# Altium project EL.PLAM.T01.PrjPcb
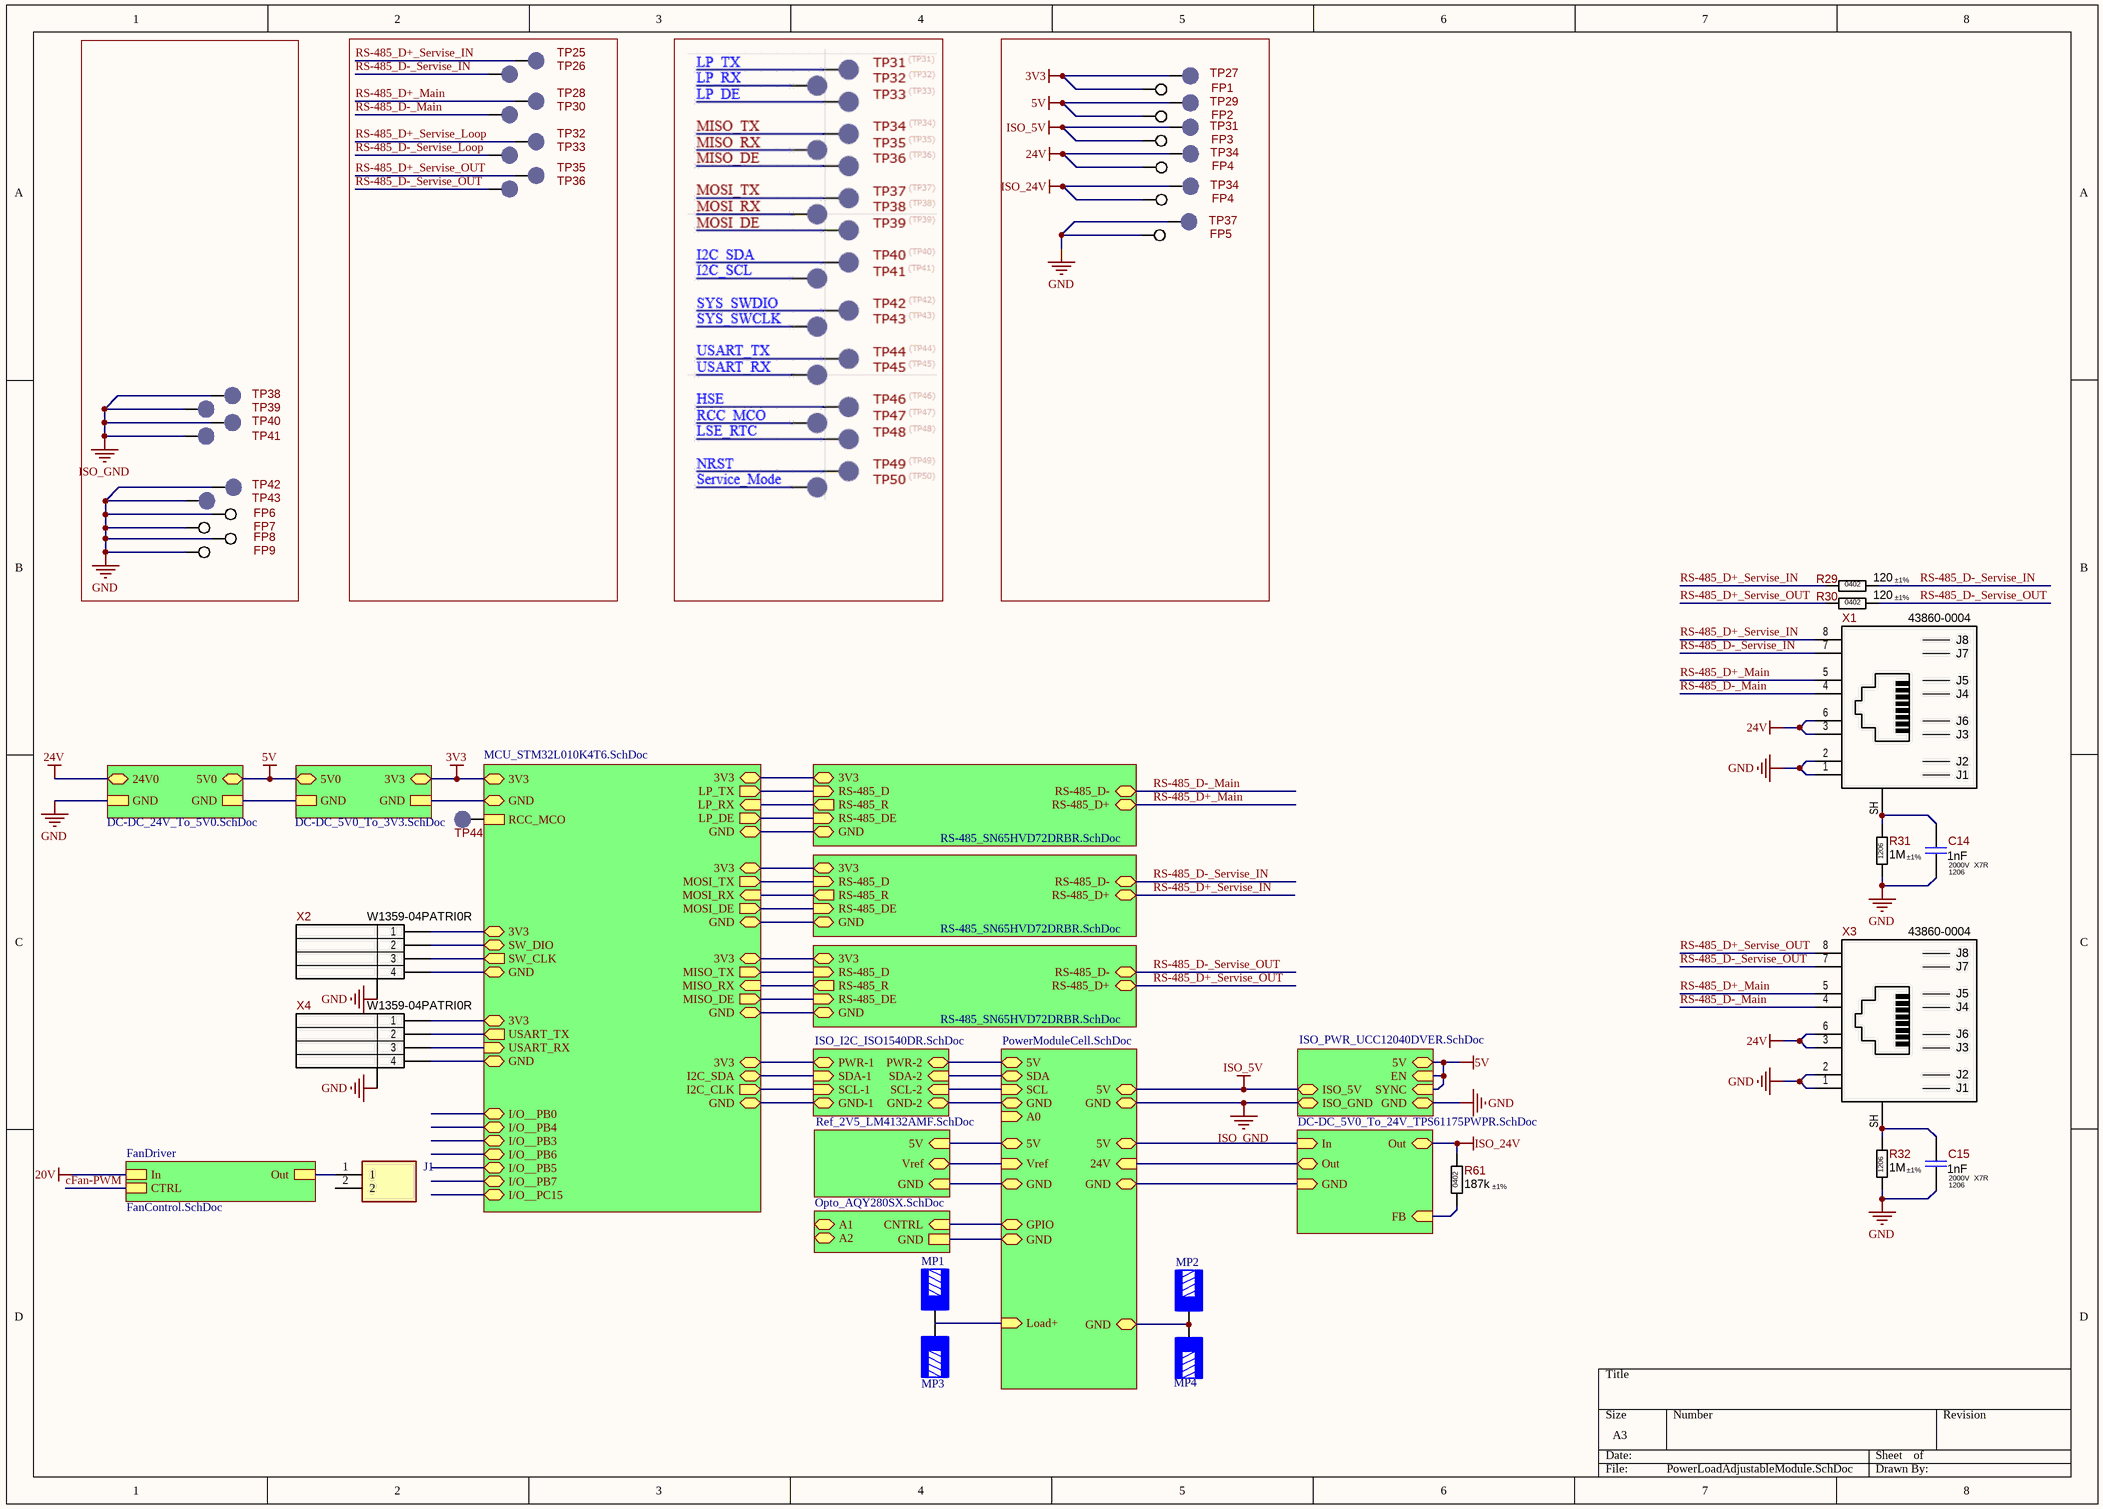
[diagram p0: PowerLoadAdjustableModule.SchDoc]
3 sheets, 121 parts. Net scope: hierarchical (ports join the sheet entries above them; power ports are global).
Board file: PowerLoadAdjustableModule.PcbDoc
Sheets:
  PowerLoadAdjustableModule.SchDoc
    PowerModuleCell = PowerModuleCell.SchDoc
    FanDriver = FanControl.SchDoc

## Sheet PowerLoadAdjustableModule.SchDoc
size A3; SheetNumber: 1; SheetTotal: 8

### Parts
(Parts that share a designator on the sheet are numbered #1, #2 ... from top to bottom, then left to right.)
C14  Package: 1206  Voltage: 2000V  Dielectric Type: X7R  [CAP-1206(3216)X125T20]  (hidden comment: 1nF)
C15  Package: 1206  Voltage: 2000V  Dielectric Type: X7R  [CAP-1206(3216)X125T20]  (hidden comment: 1nF)
FP1  PAD-1.1mm  [PAD-1.1mm]  (value not drawn)  (no BOM)
FP2  PAD-1.1mm  [PAD-1.1mm]  (value not drawn)  (no BOM)
FP3  PAD-1.1mm  [PAD-1.1mm]  (value not drawn)  (no BOM)
FP4#1  PAD-1.1mm  [PAD-1.1mm]  (value not drawn)  (no BOM)
FP4#2  PAD-1.1mm  [PAD-1.1mm]  (value not drawn)  (no BOM)
FP5  PAD-1.1mm  [PAD-1.1mm]  (value not drawn)  (no BOM)
FP6  PAD-1.1mm  [PAD-1.1mm]  (value not drawn)  (no BOM)
FP7  PAD-1.1mm  [PAD-1.1mm]  (value not drawn)  (no BOM)
FP8  PAD-1.1mm  [PAD-1.1mm]  (value not drawn)  (no BOM)
FP9  PAD-1.1mm  [PAD-1.1mm]  (value not drawn)  (no BOM)
J1  1725656  [1725656]  (value not drawn)
MP1  M6 x 9mm  [7461084_HAL]  (value not drawn)
MP2  M6 x 9mm  [7461084_HAL]  (value not drawn)
MP3  M6 x 9mm  [7461084_HAL]  (value not drawn)
MP4  M6 x 9mm  [7461084_HAL]  (value not drawn)
R29  Tolerance: ±1%  Package: 0402  [R_ANY_CHIP_0402_HI]  (hidden comment: 120)
R30  Tolerance: ±1%  Package: 0402  [R_ANY_CHIP_0402_HI]  (hidden comment: 120)
R31  Tolerance: ±1%  Package: 1206  [CHV1206-Series]  (hidden comment: 1M)
R32  Tolerance: ±1%  Package: 1206  [CHV1206-Series]  (hidden comment: 1M)
R61  Tolerance: ±1%  Package: 0402  [R_ANY_CHIP_0402_MED]  (hidden comment: 187k)
TP25  LED_LINK  [TP_SMD_2mm]  (value not drawn)  (no BOM)
TP26  LED_LINK  [TP_SMD_2mm]  (value not drawn)  (no BOM)
TP27  LED_LINK  [TP_SMD_2mm]  (value not drawn)  (no BOM)
TP28  LED_LINK  [TP_SMD_2mm]  (value not drawn)  (no BOM)
TP29  LED_LINK  [TP_SMD_2mm]  (value not drawn)  (no BOM)
TP30  LED_LINK  [TP_SMD_2mm]  (value not drawn)  (no BOM)
TP31  LED_LINK  [TP_SMD_2mm]  (value not drawn)  (no BOM)
TP32  LED_LINK  [TP_SMD_2mm]  (value not drawn)  (no BOM)
TP33  LED_LINK  [TP_SMD_2mm]  (value not drawn)  (no BOM)
TP34#1  LED_LINK  [TP_SMD_2mm]  (value not drawn)  (no BOM)
TP34#2  LED_LINK  [TP_SMD_2mm]  (value not drawn)  (no BOM)
TP35  LED_LINK  [TP_SMD_2mm]  (value not drawn)  (no BOM)
TP36  LED_LINK  [TP_SMD_2mm]  (value not drawn)  (no BOM)
TP37  LED_LINK  [TP_SMD_2mm]  (value not drawn)  (no BOM)
TP38  LED_LINK  [TP_SMD_2mm]  (value not drawn)  (no BOM)
TP39  LED_LINK  [TP_SMD_2mm]  (value not drawn)  (no BOM)
TP40  LED_LINK  [TP_SMD_2mm]  (value not drawn)  (no BOM)
TP41  LED_LINK  [TP_SMD_2mm]  (value not drawn)  (no BOM)
TP42  LED_LINK  [TP_SMD_2mm]  (value not drawn)  (no BOM)
TP43  LED_LINK  [TP_SMD_2mm]  (value not drawn)  (no BOM)
TP44  LED_LINK  [TP_SMD_2mm]  (value not drawn)  (no BOM)
X1  43860-0004  [43860-0004]
X2  W1359-04PATRI0R  [W1359-04PATXI0R_DBG]
X3  43860-0004  [43860-0004]
X4  W1359-04PATRI0R  [W1359-04PATXI0R_DBG]

### Sub-sheets
CellSelectModule = Opto_AQY280SX.SchDoc (file not in this document): CNTRL (in), A1 (bidir), A2 (bidir), GND
FanDriver = FanControl.SchDoc: In, Out, CTRL
ISO_5V = ISO_PWR_UCC12040DVER.SchDoc (file not in this document): ISO_5V (bidir), 5V (bidir), GND (bidir), ISO_GND (bidir), EN (in), SYNC (in)
ISO_I2C = ISO_I2C_ISO1540DR.SchDoc (file not in this document): PWR-2 (bidir), PWR-1 (bidir), GND-1 (bidir), GND-2 (bidir), SDA-1 (in), SCL-1 (in), SDA-2 (in), SCL-2 (in)
ISO_I2C = Ref_2V5_LM4132AMF.SchDoc (file not in this document): Vref (bidir), 5V (in), GND (in)
ISO_I2C = DC-DC_5V0_To_24V_TPS61175PWPR.SchDoc (file not in this document): Out (bidir), In (in), GND (in), Out (bidir), FB (in)
LDO_3V3 = DC-DC_5V0_To_3V3.SchDoc (file not in this document): 3V3 (bidir), 5V0 (bidir), GND, GND
LDO_3V3 = DC-DC_24V_To_5V0.SchDoc (file not in this document): 5V0 (bidir), 24V0 (bidir), GND, GND
MCU = MCU_STM32L010K4T6.SchDoc (file not in this document): LP_TX (out), LP_RX (in), LP_DE (out), MISO_TX (out), MISO_RX (in), MISO_DE (out), MOSI_RX (in), MOSI_TX (out), MOSI_DE (out), I2C_SDA (bidir), I2C_CLK (out), SW_DIO (bidir), SW_CLK (out), USART_TX (out), USART_RX (in), RCC_MCO, I/O__PB0 (bidir), I/O__PB3 (bidir), I/O__PB4 (bidir), I/O__PB5 (bidir), I/O__PB6 (bidir), I/O__PB7 (bidir), I/O__PC15 (bidir), 3V3 (bidir), 3V3 (bidir), 3V3 (bidir), 3V3 (bidir), 3V3 (bidir), GND (bidir), GND (bidir), GND (bidir), GND (bidir), GND (bidir), GND (bidir), GND (bidir), 3V3 (bidir), 3V3 (bidir)
PowerModuleCell = PowerModuleCell.SchDoc: 5V (bidir), GND (bidir), SDA (bidir), SCL (in), Load+ (in), 24V (in), A0 (in), GPIO (bidir), GND (bidir), 5V (bidir), Vref (in), 5V (bidir), GND (bidir), GND (bidir), GND (bidir), GND (bidir), 5V (bidir)
RS-485 = RS-485_SN65HVD72DRBR.SchDoc (file not in this document): 3V3 (bidir), RS-485_D+ (bidir), RS-485_D- (bidir), RS-485_R (out), RS-485_D (in), RS-485_DE (in), GND (bidir)
RS-485 = RS-485_SN65HVD72DRBR.SchDoc (file not in this document): 3V3 (bidir), RS-485_D+ (bidir), RS-485_D- (bidir), RS-485_R (out), RS-485_D (in), RS-485_DE (in), GND (bidir)
RS-485 = RS-485_SN65HVD72DRBR.SchDoc (file not in this document): 3V3 (bidir), RS-485_D+ (bidir), RS-485_D- (bidir), RS-485_R (out), RS-485_D (in), RS-485_DE (in), GND (bidir)

### Nets
3V3: FP1.1 TP27.1 ; sheet LDO_3V3/3V3, sheet MCU/3V3
5V: FP2.1 TP29.1 ; sheet LDO_3V3/5V0, sheet ISO_5V/5V, sheet ISO_5V/EN, sheet ISO_5V/SYNC, sheet LDO_3V3/5V0
24V: FP4#1.1 TP34#1.1 X1.3(TD3-) X1.6(CT) X3.3(TD3-) X3.6(CT) ; sheet LDO_3V3/24V0
GND: C14.2 C15.2 FP5.1 FP6.1 FP7.1 FP8.1 FP9.1 R31.2 R32.2 TP37.1 TP42.1 TP43.1 X1.1(TD4-) X1.2(TD4+) X2.MP(MountPad) X3.1(TD4-) X3.2(TD4+) X4.MP(MountPad) ; sheet ISO_5V/GND, sheet LDO_3V3/GND
ISO_5V: FP3.1 TP31.1 ; sheet ISO_5V/ISO_5V, sheet ISO_I2C/PWR-2, sheet PowerModuleCell/5V, sheet PowerModuleCell/5V, sheet PowerModuleCell/5V, sheet PowerModuleCell/5V, sheet ISO_I2C/5V, sheet ISO_I2C/In
ISO_24V: FP4#2.1 R61.1 TP34#2.1 ; sheet ISO_I2C/Out
ISO_GND: MP2.1 MP4.1 TP38.1 TP39.1 TP40.1 TP41.1 ; sheet ISO_5V/ISO_GND, sheet ISO_I2C/GND-2, sheet PowerModuleCell/GND, sheet PowerModuleCell/GND, sheet PowerModuleCell/GND, sheet PowerModuleCell/GND, sheet PowerModuleCell/GND, sheet PowerModuleCell/GND, sheet ISO_I2C/GND, sheet CellSelectModule/GND, sheet ISO_I2C/GND
RS-485_D+_Main: TP28.1 X1.5(CT) X3.5(CT) ; sheet RS-485/RS-485_D+
RS-485_D+_Servise_IN: R29.1 TP25.1 X1.8(TD2+) ; sheet RS-485/RS-485_D+
RS-485_D+_Servise_Loop: TP32.1
RS-485_D+_Servise_OUT: R30.1 TP35.1 X3.8(TD2+) ; sheet RS-485/RS-485_D+
RS-485_D-_Main: TP30.1 X1.4(TD3+) X3.4(TD3+) ; sheet RS-485/RS-485_D-
RS-485_D-_Servise_IN: R29.2 TP26.1 X1.7(TD2-) ; sheet RS-485/RS-485_D-
RS-485_D-_Servise_Loop: TP33.1
RS-485_D-_Servise_OUT: R30.2 TP36.1 X3.7(TD2-) ; sheet RS-485/RS-485_D-
Vout: J1.1 ; sheet FanDriver/Out
NetC1_2: sheet PowerModuleCell/24V, sheet ISO_I2C/Out
NetC14_1: C14.1 R31.1 X1.SH(Shield)
NetC15_1: C15.1 R32.1 X3.SH(Shield)
NetMP1_1: MP1.1 MP3.1
NetR61_2: R61.2 ; sheet ISO_I2C/FB
NetTP44_1: TP44.1 ; sheet MCU/RCC_MCO
NetU2_A1: sheet PowerModuleCell/Vref, sheet ISO_I2C/Vref
NetU2_A4: sheet PowerModuleCell/GPIO, sheet CellSelectModule/CNTRL
NetU2_B4: sheet ISO_I2C/SCL-2, sheet PowerModuleCell/SCL
NetU2_D4: sheet ISO_I2C/SDA-2, sheet PowerModuleCell/SDA
NetX2_1: X2.1 ; sheet MCU/3V3
NetX2_2: X2.2 ; sheet MCU/SW_DIO
NetX2_3: X2.3 ; sheet MCU/SW_CLK
NetX2_4: X2.4 ; sheet MCU/GND
NetX4_1: X4.1 ; sheet MCU/3V3
NetX4_2: X4.2 ; sheet MCU/USART_TX
NetX4_3: X4.3 ; sheet MCU/USART_RX
NetX4_4: X4.4 ; sheet MCU/GND
(unnamed): sheet LDO_3V3/GND, sheet MCU/GND
(unnamed): sheet LDO_3V3/GND, sheet LDO_3V3/GND
(unnamed): sheet ISO_I2C/PWR-1, sheet MCU/3V3
(unnamed): sheet ISO_I2C/GND-1, sheet MCU/GND
(unnamed): sheet ISO_I2C/SDA-1, sheet MCU/I2C_SDA
(unnamed): sheet ISO_I2C/SCL-1, sheet MCU/I2C_CLK
(unnamed): sheet MCU/LP_TX, sheet RS-485/RS-485_D
(unnamed): sheet MCU/LP_RX, sheet RS-485/RS-485_R
(unnamed): sheet MCU/LP_DE, sheet RS-485/RS-485_DE
(unnamed): sheet MCU/MISO_TX, sheet RS-485/RS-485_D
(unnamed): sheet MCU/MISO_RX, sheet RS-485/RS-485_R
(unnamed): sheet MCU/MISO_DE, sheet RS-485/RS-485_DE
(unnamed): sheet MCU/MOSI_RX, sheet RS-485/RS-485_R
(unnamed): sheet MCU/MOSI_TX, sheet RS-485/RS-485_D
(unnamed): sheet MCU/MOSI_DE, sheet RS-485/RS-485_DE
(unnamed): sheet MCU/3V3, sheet RS-485/3V3
(unnamed): sheet MCU/3V3, sheet RS-485/3V3
(unnamed): sheet MCU/GND, sheet RS-485/GND
(unnamed): sheet MCU/GND, sheet RS-485/GND
(unnamed): sheet MCU/GND, sheet RS-485/GND
(unnamed): sheet MCU/3V3, sheet RS-485/3V3

Not connected (* = marked no-connect by the designer): J1 2

### Notes on the sheet
- (in symbol 43860-0004) J8; J7; J5; J4; J6; J3; J2; J1

### Library data of the parts
C14 C15 = Capacitor-NonPolar: 1nF 2000V X7R ±10% 1206 Ceramic Capacitor RoHS; Part Number: CC1206KKX7RDBB102; Manufacturer: Yageo; Replacement: NONE; Value: 1nF; Part Type: Ceramic / X7R / 1206; Component Type: SMD; Temperature Range: -55°C ~ 125°C; Tolerance: ±10%; ComponentLink1URL: https://www.yageo.com/upload/media/product/products/datasheet/mlcc/UPY-NP0X7R_HV_1KV-to-3KV_11.pdf; Supplier 1: Digi-Key; Supplier Part Number 1: 311-1487-2-ND; ComponentLink1Description: Datasheet
FP1-FP3 FP4#1 FP4#2 FP5-FP9 = Pad: 1.1mm Pad for Plug-In or Receptacle; Manufacturer: NONE; Component Status: Released; Part Number: PAD-1.1mm; Component Type: PTH; Part Type: Pad; Temperature Range: NONE; ComponentLink1URL: NONE; Replacement: NONE; ComponentLink1Description: Datasheet; Price: NONE
J1 = 1725656: Connector; Manufacturer_Name: Phoenix Contact; Datasheet Link: https://www.phoenixcontact.com/online/portal/us/?uri=pxc-oc-itemdetail:pid=1725656&library=usen&pcck=P-11-01-05&tab=1&selectedCategory=ALL; Height: 8.65mm; Manufacturer_Part_Number: 1725656; Mouser Part Number: 651-1725656; Mouser Price/Stock: https://www.mouser.co.uk/ProductDetail/Phoenix-Contact/1725656?qs=Ul7CXFMnlWWQeccayYbRmw%3D%3D; Arrow Part Number: 1725656; Arrow Price/Stock: https://www.arrow.com/en/products/1725656/phoenix-contact?utm_currency=USD&region=nac
MP1-MP4 = 7461084: WP-BUTR REDCUBE PRESS-FIT with internal thread, two-rows, L10W10H13.5mm, M6 x 9mm, 160A; Manufacturer: Wurth Elektronik; Surface: Tin; ComponentLink1Description: Website Link; ComponentLink1URL: https://www.we-online.com/redexpert/article/7461084?ad; ComponentLink2Description: Datasheet Link; ComponentLink2URL: https://www.we-online.com/redexpert/spec/7461084?ad; Manufacturer Part Number: 7461084; Category: REDCUBE PRESS-FIT; Match Code: WP-BUTR; Mount: Press Fit; Operating Temperature Max: 150°C; Operating Temperature Min: -55°C; Packaging: Bulk; Length: 10mm; Width: 10mm; Height: 13.5mm; Material: Brass; Number of Pins: 8; Rated Current: 160A; Thread Length: 9mm; Thread Size: M6; Supplier 1: Mouser; Supplier Part Number 1: 710-7461084
R29 R30 = Resistor: 120 Ohms ±1% 1/16W 0402 Thick Film Resistor; Part Number: RC0402FR-07120RL; Manufacturer: Yageo; Power Rating: 0.062W; Voltage: 50V; Component Status: Released; Temperature Stability: ±100ppm/°C; Replacement: NONE; Value: 120; Component Type: SMD; Part Type: Thick Film; Temperature Range: -55°C ~ 155°C; ComponentLink1URL: https://eu.mouser.com/datasheet/2/447/PYu_RC_Group_51_RoHS_L_10-1664068.pdf; Price: 0.00065; ComponentLink1Description: Datasheet
R31 R32 = Resistor: 1 MOhms ±1%, 1/4W 1206 Thick Film Resistor; Part Number: CHV1206-FX-1004ELF; Manufacturer: Bourns; Power Rating: 0.25W; Voltage: 800V; Component Status: Released; Temperature Stability: ±100ppm/°C; Replacement: NONE; Value: 1M; Component Type: SMD; Part Type: Thick Film; Temperature Range: -55°C ~ 155°C; ComponentLink1URL: https://eu.mouser.com/datasheet/2/54/CHV-777595.pdf; Supplier 1: Mouser; Supplier Part Number 1: 652-CHV1206FX1004ELF; Price: 0.0173216; ComponentLink1Description: Datasheet
R61 = Resistor: 187 kOhms ±1% 1/16W 0402 Thick Film Resistor; Part Number: RC0402FR-07187KL; Manufacturer: Yageo; Power Rating: 0.062W; Voltage: 50V; Component Status: Released; Temperature Stability: ±100ppm/°C; Replacement: NONE; Value: 187k; Component Type: SMD; Part Type: Thick Film; Temperature Range: -55°C ~ 155°C; ComponentLink1URL: https://eu.mouser.com/datasheet/2/447/YAGEO_PYu_RC_Group_51_RoHS_L_12-3313492.pdf; Supplier 1: Digi-Key; Supplier Part Number 1: 311-187KLRTR-ND; Price: NONE; ComponentLink1Description: Datasheet
TP25-TP33 TP34#1 TP34#2 TP35-TP44 = Test-Point-SMD-1: Test Point SMD Pad 1.0mm/1.5mm/2mm; Part Number: TP-PAD-SMD; Replacement: NONE; Part Type: Test Point; Component Type: SMD; Temperature Range: NONE; ComponentLink1URL: NONE; ComponentLink1Description: Datasheet
X1 X3 = 43860-0004: RJ45 8P8C Shielded Cat 3 10 Base-T Connector; Manufacturer: Molex; Component Status: Released; Replacement: NONE; Part Number: 43860-0004; Part Type: RJ-45; Component Type: PTH; Temperature Range: -40°C ~ 85°C; ComponentLink1URL: https://www.molex.com/pdm_docs/sd/438600004_sd.pdf; Supplier 1: Mouser; Supplier Part Number 1: 538-43860-0004; Price: 2.1435; ComponentLink1Description: Datasheet
X2 X4 = General-4-Pin-MP: 1.25mm Wire-to-Board Header, Vertical, SMT, 4 pin; Manufacturer: Hsuan Mao Technology; Component Status: Released; Replacement: 53398-0471; Part Number: W1359-04PATRI0R; Part Type: Wire-to-Board / 1.25mm; Component Type: SMD; Temperature Range: -40°C ~ 85°C; Price: 0.06

## Sheet PowerModuleCell.SchDoc
size A4; SheetNumber: 2; SheetTotal: 12
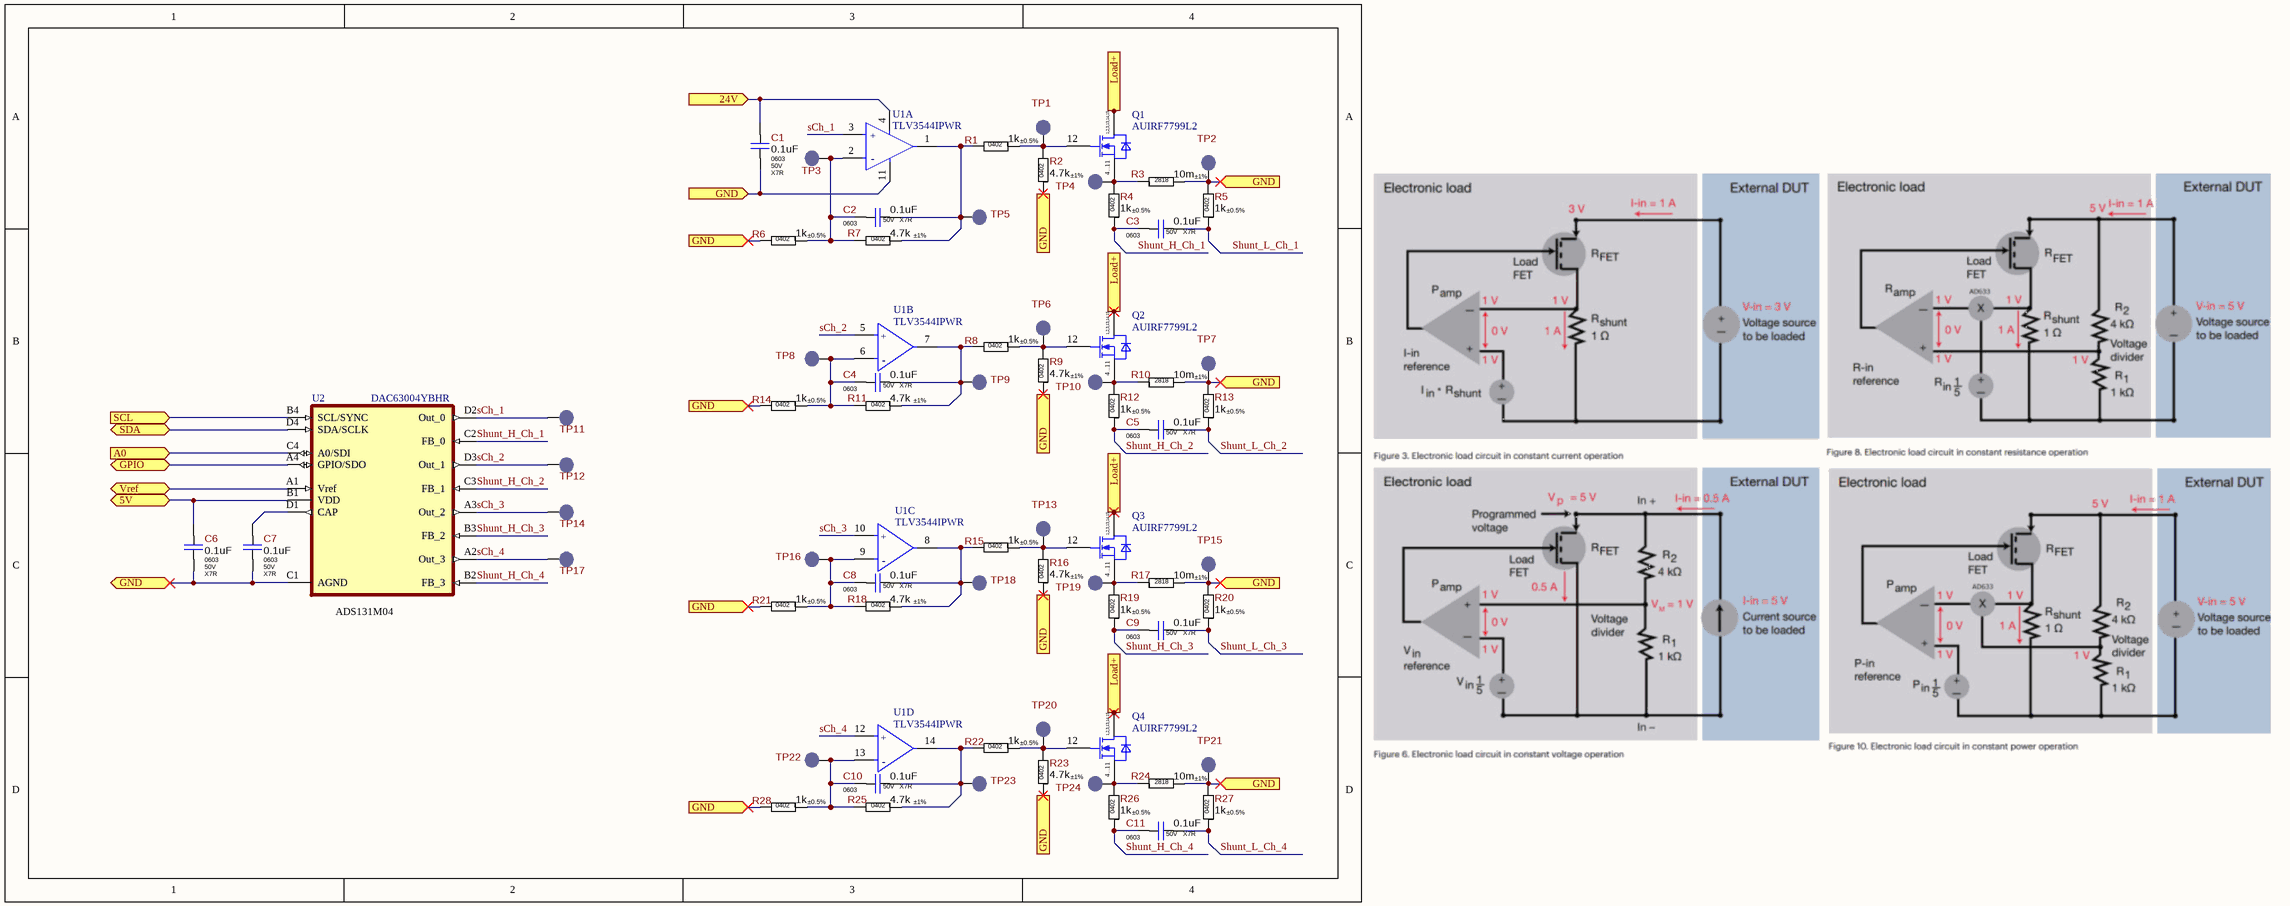
[diagram p1: PowerModuleCell.SchDoc]

### Parts
C1  Package: 0603  Voltage: 50V  Dielectric Type: X7R  [C_CERAMIC_0603_MED]  (hidden comment: 0.1uF)
C2  Package: 0603  Voltage: 50V  Dielectric Type: X7R  [C_CERAMIC_0603_MED]  (hidden comment: 0.1uF)
C3  Package: 0603  Voltage: 50V  Dielectric Type: X7R  [C_CERAMIC_0603_MED]  (hidden comment: 0.1uF)
C4  Package: 0603  Voltage: 50V  Dielectric Type: X7R  [C_CERAMIC_0603_MED]  (hidden comment: 0.1uF)
C5  Package: 0603  Voltage: 50V  Dielectric Type: X7R  [C_CERAMIC_0603_MED]  (hidden comment: 0.1uF)
C6  Package: 0603  Voltage: 50V  Dielectric Type: X7R  [C_CERAMIC_0603_MED]  (hidden comment: 0.1uF)
C7  Package: 0603  Voltage: 50V  Dielectric Type: X7R  [C_CERAMIC_0603_MED]  (hidden comment: 0.1uF)
C8  Package: 0603  Voltage: 50V  Dielectric Type: X7R  [C_CERAMIC_0603_MED]  (hidden comment: 0.1uF)
C9  Package: 0603  Voltage: 50V  Dielectric Type: X7R  [C_CERAMIC_0603_MED]  (hidden comment: 0.1uF)
C10  Package: 0603  Voltage: 50V  Dielectric Type: X7R  [C_CERAMIC_0603_MED]  (hidden comment: 0.1uF)
C11  Package: 0603  Voltage: 50V  Dielectric Type: X7R  [C_CERAMIC_0603_MED]  (hidden comment: 0.1uF)
Q1  AUIRF7799L2  [DIRECTFET-L8-V]
Q2  AUIRF7799L2  [DIRECTFET-L8-V]
Q3  AUIRF7799L2  [DIRECTFET-L8-V]
Q4  AUIRF7799L2  [DIRECTFET-L8-V]
R1  Tolerance: ±0.5%  Package: 0402  [R_ANY_CHIP_0402_HI]  (hidden comment: 1k)
R2  Tolerance: ±1%  Package: 0402  [R_ANY_CHIP_0402_HI]  (hidden comment: 4.7k)
R3  Tolerance: ±1%  Package: 2818  [WSHP2818]  (hidden comment: 10m)
R4  Tolerance: ±0.5%  Package: 0402  [R_ANY_CHIP_0402_HI]  (hidden comment: 1k)
R5  Tolerance: ±0.5%  Package: 0402  [R_ANY_CHIP_0402_HI]  (hidden comment: 1k)
R6  Tolerance: ±0.5%  Package: 0402  [R_ANY_CHIP_0402_HI]  (hidden comment: 1k)
R7  Tolerance: ±1%  Package: 0402  [R_ANY_CHIP_0402_HI]  (hidden comment: 4.7k)
R8  Tolerance: ±0.5%  Package: 0402  [R_ANY_CHIP_0402_HI]  (hidden comment: 1k)
R9  Tolerance: ±1%  Package: 0402  [R_ANY_CHIP_0402_HI]  (hidden comment: 4.7k)
R10  Tolerance: ±1%  Package: 2818  [WSHP2818]  (hidden comment: 10m)
R11  Tolerance: ±1%  Package: 0402  [R_ANY_CHIP_0402_HI]  (hidden comment: 4.7k)
R12  Tolerance: ±0.5%  Package: 0402  [R_ANY_CHIP_0402_HI]  (hidden comment: 1k)
R13  Tolerance: ±0.5%  Package: 0402  [R_ANY_CHIP_0402_HI]  (hidden comment: 1k)
R14  Tolerance: ±0.5%  Package: 0402  [R_ANY_CHIP_0402_HI]  (hidden comment: 1k)
R15  Tolerance: ±0.5%  Package: 0402  [R_ANY_CHIP_0402_HI]  (hidden comment: 1k)
R16  Tolerance: ±1%  Package: 0402  [R_ANY_CHIP_0402_HI]  (hidden comment: 4.7k)
R17  Tolerance: ±1%  Package: 2818  [WSHP2818]  (hidden comment: 10m)
R18  Tolerance: ±1%  Package: 0402  [R_ANY_CHIP_0402_HI]  (hidden comment: 4.7k)
R19  Tolerance: ±0.5%  Package: 0402  [R_ANY_CHIP_0402_HI]  (hidden comment: 1k)
R20  Tolerance: ±0.5%  Package: 0402  [R_ANY_CHIP_0402_HI]  (hidden comment: 1k)
R21  Tolerance: ±0.5%  Package: 0402  [R_ANY_CHIP_0402_HI]  (hidden comment: 1k)
R22  Tolerance: ±0.5%  Package: 0402  [R_ANY_CHIP_0402_HI]  (hidden comment: 1k)
R23  Tolerance: ±1%  Package: 0402  [R_ANY_CHIP_0402_HI]  (hidden comment: 4.7k)
R24  Tolerance: ±1%  Package: 2818  [WSHP2818]  (hidden comment: 10m)
R25  Tolerance: ±1%  Package: 0402  [R_ANY_CHIP_0402_HI]  (hidden comment: 4.7k)
R26  Tolerance: ±0.5%  Package: 0402  [R_ANY_CHIP_0402_HI]  (hidden comment: 1k)
R27  Tolerance: ±0.5%  Package: 0402  [R_ANY_CHIP_0402_HI]  (hidden comment: 1k)
R28  Tolerance: ±0.5%  Package: 0402  [R_ANY_CHIP_0402_HI]  (hidden comment: 1k)
TP1  LED_LINK  [TP_SMD_2mm]  (value not drawn)  (no BOM)
TP2  LED_LINK  [TP_SMD_2mm]  (value not drawn)  (no BOM)
TP3  LED_LINK  [TP_SMD_2mm]  (value not drawn)  (no BOM)
TP4  LED_LINK  [TP_SMD_2mm]  (value not drawn)  (no BOM)
TP5  LED_LINK  [TP_SMD_2mm]  (value not drawn)  (no BOM)
TP6  LED_LINK  [TP_SMD_2mm]  (value not drawn)  (no BOM)
TP7  LED_LINK  [TP_SMD_2mm]  (value not drawn)  (no BOM)
TP8  LED_LINK  [TP_SMD_2mm]  (value not drawn)  (no BOM)
TP9  LED_LINK  [TP_SMD_2mm]  (value not drawn)  (no BOM)
TP10  LED_LINK  [TP_SMD_2mm]  (value not drawn)  (no BOM)
TP11  LED_LINK  [TP_SMD_2mm]  (value not drawn)  (no BOM)
TP12  LED_LINK  [TP_SMD_2mm]  (value not drawn)  (no BOM)
TP13  LED_LINK  [TP_SMD_2mm]  (value not drawn)  (no BOM)
TP14  LED_LINK  [TP_SMD_2mm]  (value not drawn)  (no BOM)
TP15  LED_LINK  [TP_SMD_2mm]  (value not drawn)  (no BOM)
TP16  LED_LINK  [TP_SMD_2mm]  (value not drawn)  (no BOM)
TP17  LED_LINK  [TP_SMD_2mm]  (value not drawn)  (no BOM)
TP18  LED_LINK  [TP_SMD_2mm]  (value not drawn)  (no BOM)
TP19  LED_LINK  [TP_SMD_2mm]  (value not drawn)  (no BOM)
TP20  LED_LINK  [TP_SMD_2mm]  (value not drawn)  (no BOM)
TP21  LED_LINK  [TP_SMD_2mm]  (value not drawn)  (no BOM)
TP22  LED_LINK  [TP_SMD_2mm]  (value not drawn)  (no BOM)
TP23  LED_LINK  [TP_SMD_2mm]  (value not drawn)  (no BOM)
TP24  LED_LINK  [TP_SMD_2mm]  (value not drawn)  (no BOM)
U1  TLV3544IPWR  [TSSOP-14]  (parts A,B,C,D of 4)
U2  DAC63004YBHR  [BGA16C50P4X4_200X200X60]

### Ports
5V (bidir, see PowerLoadAdjustableModule[5C], DC-DC_5V0_To_24V_TPS61175PWPR[1B], Ref_2V5_LM4132AMF[2B]), 24V (in, see PowerLoadAdjustableModule[5D], DC-DC_5V0_To_24V_TPS61175PWPR[3B]), A0 (in, see PowerLoadAdjustableModule[4C]), GND (bidir, see PowerLoadAdjustableModule[5C], DC-DC_5V0_To_24V_TPS61175PWPR[1C], DC-DC_5V0_To_24V_TPS61175PWPR[3C], Opto_AQY280SX[2C], Ref_2V5_LM4132AMF[2B]), GND (in, see PowerLoadAdjustableModule[5C], DC-DC_5V0_To_24V_TPS61175PWPR[1C], DC-DC_5V0_To_24V_TPS61175PWPR[3C], Opto_AQY280SX[2C], Ref_2V5_LM4132AMF[2B]), GPIO (bidir, see PowerLoadAdjustableModule[4D]), Load+ (in, see PowerLoadAdjustableModule[4D]), SCL (in, see PowerLoadAdjustableModule[4C]), SDA (bidir, see PowerLoadAdjustableModule[4C]), Vref (bidir, see PowerLoadAdjustableModule[4D], Ref_2V5_LM4132AMF[3B])

### Nets
ISO_5V: C6.2 U2.B1(VDD) ; port 5V
ISO_GND: C1.1 C6.1 C7.1 R2.2 R3.1 R5.1 R6.1 R9.2 R10.1 R13.1 R14.1 R16.2 R17.1 R20.1 R21.1 R23.2 R24.1 R27.1 R28.1 TP2.1 TP7.1 TP15.1 TP21.1 U1.11(V-) U2.C1(AGND) ; port GND
sCh_1: TP11.1 U1.3(+IN_A) U2.D2(Out_0)
sCh_2: TP12.1 U1.5(+IN_B) U2.D3(Out_1)
sCh_3: TP14.1 U1.10(+IN_C) U2.A3(Out_2)
sCh_4: TP17.1 U1.12(+IN_D) U2.A2(Out_3)
Shunt_H_Ch_1: C3.1 R4.2 U2.C2(FB_0)
Shunt_H_Ch_2: C5.1 R12.2 U2.C3(FB_1)
Shunt_H_Ch_3: C9.1 R19.2 U2.B3(FB_2)
Shunt_H_Ch_4: C11.1 R26.2 U2.B2(FB_3)
Shunt_L_Ch_1: C3.2 R5.2
Shunt_L_Ch_2: C5.2 R13.2
Shunt_L_Ch_3: C9.2 R20.2
Shunt_L_Ch_4: C11.2 R27.2
NetC1_2: C1.2 U1.4(V+) ; port 24V
NetC2_1: C2.1 R6.2 R7.1 TP3.1 U1.2(-IN_A)
NetC2_2: C2.2 R1.1 R7.2 TP5.1 U1.1(OUT_A)
NetC4_1: C4.1 R11.1 R14.2 TP8.1 U1.6(-IN_B)
NetC4_2: C4.2 R8.1 R11.2 TP9.1 U1.7(OUT_B)
NetC7_2: C7.2 U2.D1(CAP)
NetC8_1: C8.1 R18.1 R21.2 TP16.1 U1.9(-IN_C)
NetC8_2: C8.2 R15.1 R18.2 TP18.1 U1.8(OUT_C)
NetC10_1: C10.1 R25.1 R28.2 TP22.1 U1.13(-IN_D)
NetC10_2: C10.2 R22.1 R25.2 TP23.1 U1.14(OUT_D)
NetQ1_1: Q1.1(DRAIN1) Q1.2(DRAIN2) Q1.3(DRAIN3) Q1.13(DRAIN4) Q1.14(DRAIN5) Q1.15(DRAIN6) Q2.1(DRAIN1) Q2.2(DRAIN2) Q2.3(DRAIN3) Q2.13(DRAIN4) Q2.14(DRAIN5) Q2.15(DRAIN6) Q3.1(DRAIN1) Q3.2(DRAIN2) Q3.3(DRAIN3) Q3.13(DRAIN4) Q3.14(DRAIN5) Q3.15(DRAIN6) Q4.1(DRAIN1) Q4.2(DRAIN2) Q4.3(DRAIN3) Q4.13(DRAIN4) Q4.14(DRAIN5) Q4.15(DRAIN6) ; port Load+
NetQ1_4: Q1.4(SOURCE1) Q1.5(SOURCE2) Q1.6(SOURCE3) Q1.7(SOURCE4) Q1.8(SOURCE5) Q1.9(SOURCE6) Q1.10(SOURCE7) Q1.11(SOURCE8) R3.2 R4.1 TP4.1
NetQ1_12: Q1.12(GATE) R1.2 R2.1 TP1.1
NetQ2_4: Q2.4(SOURCE1) Q2.5(SOURCE2) Q2.6(SOURCE3) Q2.7(SOURCE4) Q2.8(SOURCE5) Q2.9(SOURCE6) Q2.10(SOURCE7) Q2.11(SOURCE8) R10.2 R12.1 TP10.1
NetQ2_12: Q2.12(GATE) R8.2 R9.1 TP6.1
NetQ3_4: Q3.4(SOURCE1) Q3.5(SOURCE2) Q3.6(SOURCE3) Q3.7(SOURCE4) Q3.8(SOURCE5) Q3.9(SOURCE6) Q3.10(SOURCE7) Q3.11(SOURCE8) R17.2 R19.1 TP19.1
NetQ3_12: Q3.12(GATE) R15.2 R16.1 TP13.1
NetQ4_4: Q4.4(SOURCE1) Q4.5(SOURCE2) Q4.6(SOURCE3) Q4.7(SOURCE4) Q4.8(SOURCE5) Q4.9(SOURCE6) Q4.10(SOURCE7) Q4.11(SOURCE8) R24.2 R26.1 TP24.1
NetQ4_12: Q4.12(GATE) R22.2 R23.1 TP20.1
NetU2_A1: U2.A1(Vref) ; port Vref
NetU2_A4: U2.A4(GPIO/SDO) ; port GPIO
NetU2_B4: U2.B4(SCL/SYNC) ; port SCL
NetU2_C4: U2.C4(A0/SDI) ; port A0
NetU2_D4: U2.D4(SDA/SCLK) ; port SDA

### Notes on the sheet
- (near U2) ADS131M04
- (in symbol AUIRF7799L2) 1,2,3,13,14,15; 4...11
- (in symbol TLV3544IPWR, part A) +; -
- (in symbol TLV3544IPWR, part B) +; -
- (in symbol TLV3544IPWR, part C) +; -
- (in symbol TLV3544IPWR, part D) +; -

### Library data of the parts
C1-C11 = CL10B104KB8NNNC: 100nF 50V X7R ±10% 0603 Ceramic Capacitor RoHS; Manufacturer: Samsung Electro-Mechanics; Standard Lead Time: 18 Weeks; Replacement: CL10B104KB8NNND; Component Status: Released; Part Number: CL10B104KB8NNNC; Part Type: Ceramic / X7R / 0603; Component Type: SMD; Temperature Range: -55°C ~ 125°C; Tolerance: ±10%; ComponentLink1URL: https://media.digikey.com/pdf/Data%20Sheets/Samsung%20PDFs/CL_Series_MLCC_ds.pdf; Supplier 1: Digi-Key; Supplier Part Number 1: 1276-1000-2-ND; ComponentLink1Description: Datasheet; Price: 0.00273; Value: 0.1uF
Q1-Q4 = AUIRF7799L2: Insulated-Gate Field-Effect Transistor (IGFET), N-Channel / MOSFETs DirectFET 2 250V 35A 38mOhm Automotive; Part Number: AUIRF7799L2TR; Manufacturer: Infineon; Rds On: 32 mOhm; Qg: 110 nC; Vgs: - 30 V, + 30 V; Vgs th: 4 V; Pd: 125; Max T: 175 C; Turn-On Delay: 36.3 ns; Turn-Off Delay: 73.9 ns; ComponentLink1Description: Datasheet; ComponentLink1URL: https://eu.mouser.com/datasheet/2/196/auirf7799l2-1730908.pdf; Supplier 1: Mouser; Supplier Part Number 1: 942-AUIRF7799L2TR; Product Category: MOSFETs; Transistor Polarity: N-Channel; Mounting Style: SMD/SMT; Package/Case: DirectFET-L8; Vds: 250V; Id: 35A
R1 R4-R6 R8 R12-R15 R19-R22 R26-R28 = RC0402DR-071KL: 1 kOhms ±0.5% 1/16W 0402 Thick Film Resistor; Manufacturer: Yageo; Power Rating: 0.062W; Voltage: 50V; Component Status: Released; Temperature Stability: ±100ppm/°C; Replacement: NONE; Part Number: RC0402DR-071KL; Component Type: SMD; Part Type: Thick Film; Temperature Range: -55°C ~ 155°C; ComponentLink1URL: https://www.yageo.com/upload/media/product/productsearch/datasheet/rchip/PYu-RC_Group_51_RoHS_L_12.pdf; Supplier 1: Digi-Key; Supplier Part Number 1: 13-RC0402DR-071KLTR-ND; Price: 0.015; ComponentLink1Description: Datasheet; Value: 1k
R2 R7 R9 R11 R16 R18 R23 R25 = RC0402FR-074K7L: 4.7 kOhms ±1% 1/16W 0402 Thick Film Resistor; Manufacturer: Yageo; Power Rating: 0.062W; Voltage: 50V; Component Status: Released; Temperature Stability: ±100ppm/°C; Replacement: NONE; Part Number: RC0402FR-074K7L; Component Type: SMD; Part Type: Thick Film; Temperature Range: -55°C ~ 155°C; ComponentLink1URL: https://eu.mouser.com/datasheet/2/447/PYu_RC_Group_51_RoHS_L_10-1664068.pdf; Price: 0.00065; ComponentLink1Description: Datasheet; Value: 4.7k
R3 R10 R17 R24 = WSHP2818R0100FEA: Current Sense Resistors - SMD 10W .010ohms 1%; Manufacturer: Vishay; Temperature Stability: ±100ppm/°C; Replacement: NONE; Component Status: Released; Part Number: WSHP2818R0100FEA; Component Type: SMD; Power Rating: 10W; Temperature Range: -55°C ~ 155°C; ComponentLink1URL: https://www.vishay.com/doc?30347; Supplier 1: Mouser; Supplier Part Number 1: 71-WSHP2818R0100FEA; ComponentLink1Description: Datasheet; Part Type: Thick Film; Value: 10m
TP1-TP24 = Test-Point-SMD-1: as TP25 on sheet PowerLoadAdjustableModule; Part Type: Test Point; Component Type: SMD; Temperature Range: NONE; ComponentLink1URL: NONE; ComponentLink1Description: Datasheet
U1 = TLV3544IPWR: Operational Amplifiers - Op Amps Quad 200MHz RRIO CMOS Operational Amp; Output Current per Channel: 100mA; Input Offset Voltage (Vos): 2mV; Number of Circuits: 4; Operating Supply Current: 5.2mA; Input Bias Current: 3pA; Gain Bandwidth Product: 100MHz; Slew Rate: 150V/µs; -3db Bandwidth: 200MHz; Number of Channels: 4; Max Operating Temperature: 125°C; Min Operating Temperature: -40°C; RoHS Compliant: Yes; Number of Pins: 14; Case/Package: TSSOP; Mount: Surface Mount; Packaging: Cut Tape; Part Number: TLV3544IPWR; Supplier 1: Mouser; Supplier Part Number 1: 595-TLV3544IPWR; ComponentLink1Description: Datasheet; ComponentLink1URL: https://www.ti.com/lit/gpn/tlv3544
U2 = DAC63004YBHR: Digital to Analog Converters - DAC Ultra-low-power four -channel 12-bit smar; Resolution: 12 bit; Number of Channels: 4 Channel; Settling Time: 25 us; Output Type: Current, Voltage; Interface Type: I2C, SPI; Supply Voltage - Max: 5.5 V; Supply Voltage - Min: 1.8 V; Part Number: DAC63004YBHR; Supplier 1: Mouser; Supplier Part Number 1: 595-DAC63004YBHR; ComponentLink1Description: Datasheet; ComponentLink1URL: https://www.ti.com/lit/ds/symlink/dac53004w.pdf?ts=1756086251058&ref_url=https%253A%252F%252Fwww.ti.com%252Fproduct%252FDAC53004W; Mounting Style: SMD/SMT; Package/Case: DSBGA-16; Product: Digital to Analog Converters; Product Type: DACs - Digital to Analog Converters; Subcategory: Data Converter ICs; Price, max: 4,74 €; Price, min: 2,65 €

## Sheet FanControl.SchDoc
size A4; SheetNumber: 3; SheetTotal: 12
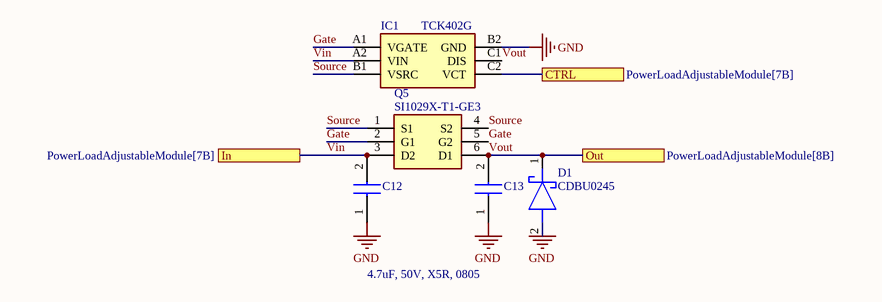
[diagram p2: FanControl.SchDoc]

### Parts
C12  4.7uF, 50V, X5R, 0805  [CAPC2012X145N]  (value not drawn)
C13  4.7uF, 50V, X5R, 0805  [CAPC2012X145N]  (value not drawn)
D1  CDBU0245  [DIOC1709X85N]
IC1  TCK402G  [BGA6C40P2X3_80X120X59]
Q5  SI1029X-T1-GE3  [SOTFL50P160X60-6N]

### Ports
CTRL (see PowerLoadAdjustableModule[7B]), In (see PowerLoadAdjustableModule[7B]), Out (see PowerLoadAdjustableModule[8B])

### Nets
GND: C12.1 C13.1 D1.2(A) IC1.B2(GND)
Vin: C12.2 IC1.A2(VIN) Q5.3(D2) ; port In
cFan-PWM: IC1.C2(VCT) ; port CTRL
Gate: IC1.A1(VGATE) Q5.2(G1) Q5.5(G2)
Source: IC1.B1(VSRC) Q5.1(S1) Q5.4(S2)
Vout: C13.2 D1.1(K) IC1.C1(DIS) Q5.6(D1) ; port Out

### Notes on the sheet
- 4.7uF, 50V, X5R, 0805

### Library data of the parts
C12 C13 = GRM21BR61H475ME51L: Capacitor; Manufacturer_Name: Murata Electronics; Datasheet Link: https://search.murata.co.jp/Ceramy/image/img/A01X/G101/ENG/GRM21BR61H475ME51-01A.pdf; Height: 1.45mm; Manufacturer_Part_Number: GRM21BR61H475ME51L; Mouser Part Number: 81-GRM21BR61H475M51L; Mouser Price/Stock: https://www.mouser.co.uk/ProductDetail/Murata-Electronics/GRM21BR61H475ME51L?qs=eeBpzGFlv%252B%2Fg0wAeHy0eJw%3D%3D; Arrow Part Number: GRM21BR61H475ME51L; Arrow Price/Stock: https://www.arrow.com/en/products/grm21br61h475me51l/murata-manufacturing?region=nac
D1 = CDBU0245: Schottky Diode; Manufacturer_Name: Comchip Technology; Datasheet Link: https://componentsearchengine.com/Datasheets/1/CDBU0245.pdf; Height: 0.85mm; Manufacturer_Part_Number: CDBU0245; Mouser Part Number: 750-CDBU0245; Mouser Price/Stock: https://www.mouser.co.uk/ProductDetail/Comchip-Technology/CDBU0245?qs=tw%252BuQ%2FB6PO2XscGM2Q%2FbYQ%3D%3D; Arrow Part Number: CDBU0245; Arrow Price/Stock: https://www.arrow.com/en/products/cdbu0245/comchip-technology?utm_currency=USD&region=nac
IC1 = TCK402G: Integrated Circuit; Manufacturer_Name: Toshiba; Datasheet Link: https://toshiba.semicon-storage.com/info/docget.jsp?did=59174&prodName=TCK402G; Height: 0.59mm; Manufacturer_Part_Number: TCK402G
Q5 = SI1029X-T1-GE3: Transistor; Manufacturer_Name: Vishay; Datasheet Link: https://www.vishay.com/docs/71435/71435.pdf; Height: 0.6mm; Manufacturer_Part_Number: SI1029X-T1-GE3; Mouser Part Number: 781-SI1029X-T1-GE3; Mouser Price/Stock: https://www.mouser.co.uk/ProductDetail/Vishay-Semiconductors/SI1029X-T1-GE3?qs=tWM4QuTcS4WFBF4Fada7Qg%3D%3D

## Nets that join several sheets
GND: PowerLoadAdjustableModule (18 pins), FanControl (C12.1 C13.1 D1.2 IC1.B2)
ISO_5V: PowerLoadAdjustableModule (FP3.1 TP31.1), PowerModuleCell (C6.2 U2.B1)
ISO_GND: PowerLoadAdjustableModule (6 pins), PowerModuleCell (25 pins)
Vout: PowerLoadAdjustableModule (J1.1), FanControl (C13.2 D1.1 IC1.C1 Q5.6)